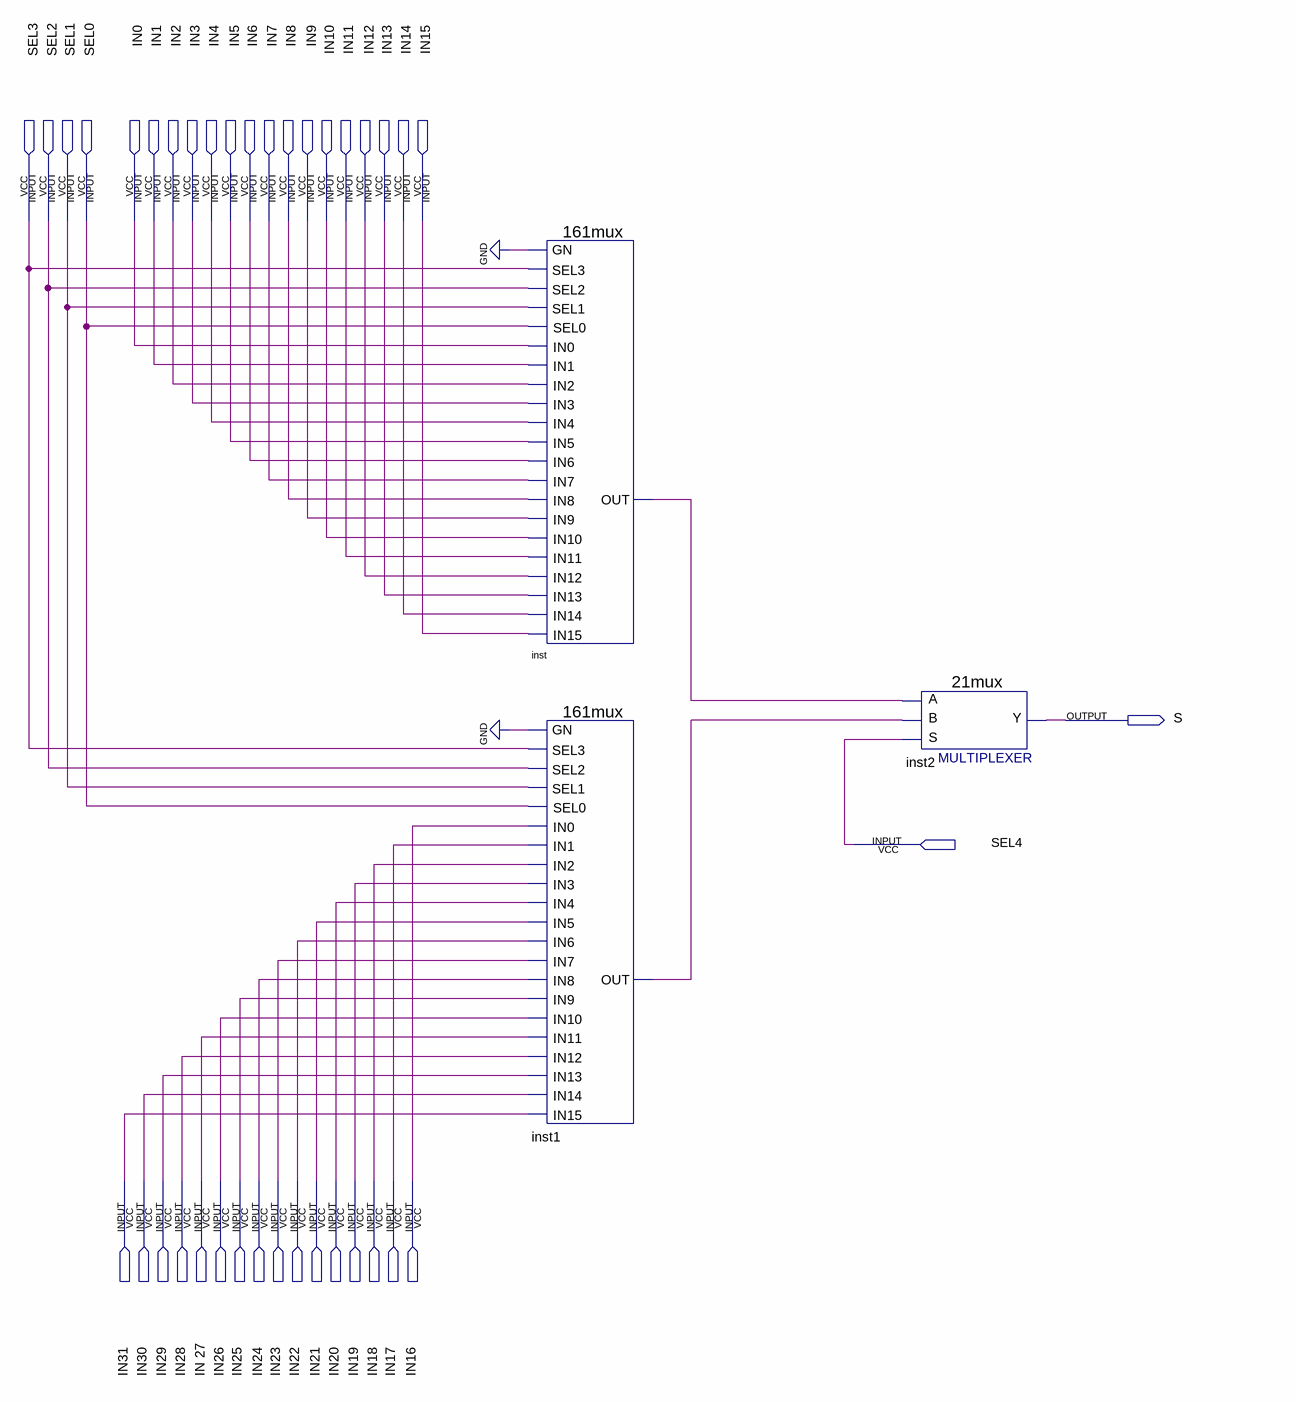
[diagram p0: schematic sheet]
// Quartus schematic MUX_32.bdf as structural Verilog: 3 symbols, 38 pins
module MUX_32 (
  input  SEL3,
  input  SEL2,
  input  SEL1,
  input  SEL0,
  input  IN0,
  input  IN1,
  input  IN2,
  input  IN3,
  input  IN4,
  input  IN5,
  input  IN6,
  input  IN7,
  input  IN8,
  input  IN9,
  input  IN10,
  input  IN11,
  input  IN12,
  input  IN13,
  input  IN14,
  input  IN15,
  input  SEL4,
  input  IN31,
  input  IN30,
  input  IN29,
  input  IN28,
  input  \IN_27 ,
  input  IN26,
  input  IN25,
  input  IN24,
  input  IN23,
  input  IN22,
  input  IN21,
  input  IN20,
  input  IN19,
  input  IN18,
  input  IN17,
  input  IN16,
  output S
);

  wire inst1_out, inst_out;

  \161mux  inst (
    .SEL3(SEL3), .GN(1'b0), .IN0(IN0), .SEL0(SEL0), .SEL1(SEL1), .SEL2(SEL2), .IN3(IN3), .IN2(IN2),
    .IN1(IN1), .IN6(IN6), .IN5(IN5), .IN4(IN4), .IN9(IN9), .IN8(IN8), .IN7(IN7), .IN11(IN11), .IN12(IN12),
    .IN10(IN10), .IN15(IN15), .IN14(IN14), .IN13(IN13), .OUT(inst_out));
  \161mux  inst1 (
    .SEL3(SEL3), .GN(1'b0), .IN0(IN16), .SEL0(SEL0), .SEL1(SEL1), .SEL2(SEL2), .IN3(IN19), .IN2(IN18),
    .IN1(IN17), .IN6(IN22), .IN5(IN21), .IN4(IN20), .IN9(IN25), .IN8(IN24), .IN7(IN23), .IN11(\IN_27 ),
    .IN12(IN28), .IN10(IN26), .IN15(IN31), .IN14(IN30), .IN13(IN29), .OUT(inst1_out));
  \21mux  inst2 (.S(SEL4), .B(inst1_out), .A(inst_out), .Y(S));
endmodule
